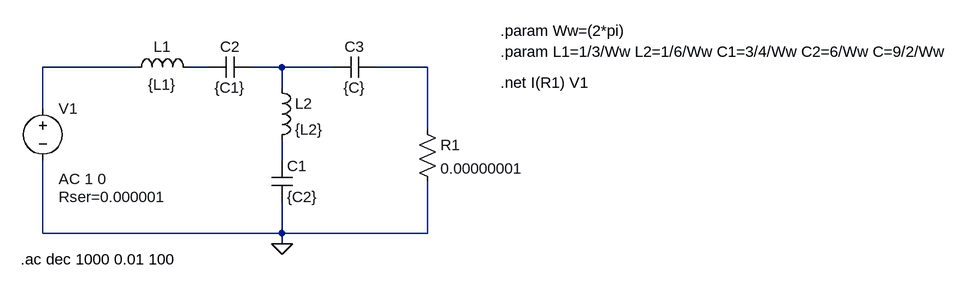
[diagram p0: schematic E1.asc]
E1.asc, the LTspice schematic file:
Version 4
SHEET 1 1372 680
WIRE 64 128 -80 128
WIRE 176 128 144 128
WIRE 288 128 240 128
WIRE 368 128 288 128
WIRE 512 128 432 128
WIRE 288 160 288 128
WIRE -80 192 -80 128
WIRE 512 224 512 128
WIRE 288 272 288 240
WIRE -80 384 -80 272
WIRE 288 384 288 336
WIRE 288 384 -80 384
WIRE 512 384 512 304
WIRE 512 384 288 384
WIRE 288 400 288 384
FLAG 288 400 0
SYMBOL ind 48 144 R270
WINDOW 0 32 56 VTop 2
WINDOW 3 5 56 VBottom 2
SYMATTR InstName L1
SYMATTR Value {L1}
SYMBOL ind 272 144 R0
SYMATTR InstName L2
SYMATTR Value {L2}
SYMBOL cap 272 272 R0
SYMATTR InstName C1
SYMATTR Value {C2}
SYMBOL cap 240 112 R90
WINDOW 0 0 32 VBottom 2
WINDOW 3 32 32 VTop 2
SYMATTR InstName C2
SYMATTR Value {C1}
SYMBOL cap 432 112 R90
WINDOW 0 0 32 VBottom 2
WINDOW 3 32 32 VTop 2
SYMATTR InstName C3
SYMATTR Value {C}
SYMBOL voltage -80 176 R0
WINDOW 123 24 124 Left 2
WINDOW 39 24 152 Left 2
SYMATTR InstName V1
SYMATTR Value ""
SYMATTR Value2 AC 1 0
SYMATTR SpiceLine Rser=0.000001
SYMBOL res 496 208 R0
SYMATTR InstName R1
SYMATTR Value 0.00000001
TEXT -114 424 Left 2 !.ac dec 1000 0.01 100
TEXT 624 72 Left 2 !.param Ww=(2*pi)
TEXT 624 104 Left 2 !.param L1=1/3/Ww L2=1/6/Ww C1=3/4/Ww C2=6/Ww C=9/2/Ww
TEXT 624 152 Left 2 !.net I(R1) V1

The netlist it stands for:
* E1.asc
L1 N001 N002 {L1}
L2 N003 N005 {L2}
C1 N005 0 {C2}
C2 N003 N002 {C1}
C3 N004 N003 {C}
V1 N001 0 AC 1 0 Rser=0.000001
R1 N004 0 0.00000001
.ac dec 1000 0.01 100
.param Ww=(2*pi)
.param L1=1/3/Ww L2=1/6/Ww C1=3/4/Ww C2=6/Ww C=9/2/Ww
.net I(R1) V1
.backanno
.end